# Altium schematic sheet dc_motor.SchDoc
size A4; Engineer: Amir Hossein Jobeiri; Organization: Simaran; SheetNumber: 4; SheetTotal: 24
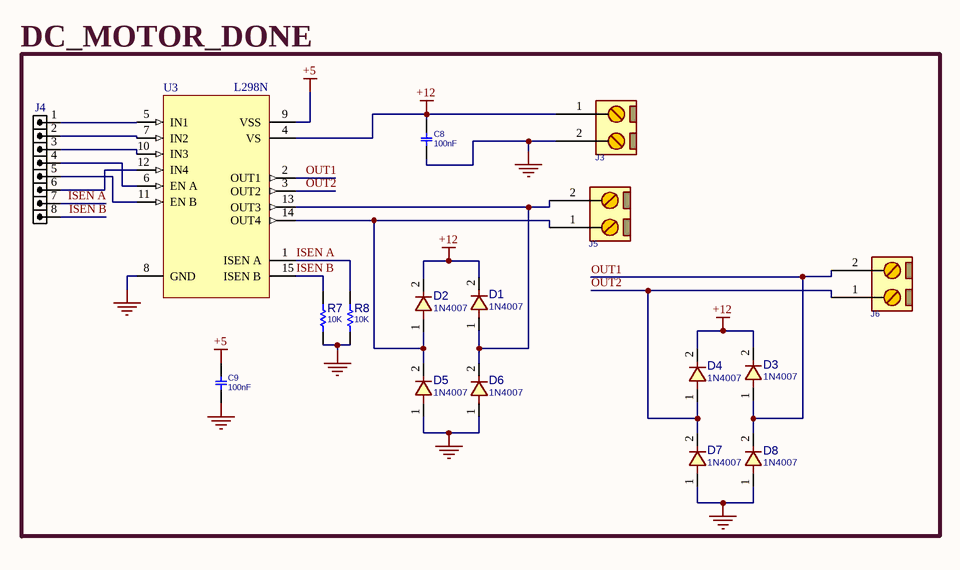
[diagram p0: dc_motor.SchDoc]

## Parts
C8  100nF  [C_CER_D3]
C9  100nF  [C_CER_D3]
D1  1N4007  [D_AX04_DO41]
D2  1N4007  [D_AX04_DO41]
D3  1N4007  [D_AX04_DO41]
D4  1N4007  [D_AX04_DO41]
D5  1N4007  [D_AX04_DO41]
D6  1N4007  [D_AX04_DO41]
D7  1N4007  [D_AX04_DO41]
D8  1N4007  [D_AX04_DO41]
J3  CONN_TB2  [TBG_2]  (value not drawn)
J4  HDR1X8  [HDR_M_1X8]  (value not drawn)
J5  CONN_TB2  [TBG_2]  (value not drawn)
J6  CONN_TB2  [TBG_2]  (value not drawn)
R7  10K  [R025W_AX04]
R8  10K  [R025W_AX04]
U3  L298N  [MULTIWATT_15V]

## Blocks framed on the sheet
DC_MOTOR_DONE: C8 C9 D1-D8 J3-J6 R7 R8 U3

## Nets
+5: C9.2 U3.9(VSS)
+12: C8.2 D1.2 D2.2 D3.2 D4.2 J3.1 U3.4(VS)
GND: C8.1 C9.1 D5.1 D6.1 D7.1 D8.1 J3.2 R7.2 R8.2 U3.8(GND)
ISEN A: J4.7 R8.1 U3.1(ISEN_A)
ISEN B: J4.8 R7.1 U3.15(ISEN_B)
OUT1: D3.1 D8.2 J6.2 U3.2(OUT1)
OUT2: D4.1 D7.2 J6.1 U3.3(OUT2)
NetD1_1: D1.1 D6.2 J5.2 U3.13(OUT3)
NetD2_1: D2.1 D5.2 J5.1 U3.14(OUT4)
NetJ4_1: J4.1 U3.5(IN1)
NetJ4_2: J4.2 U3.7(IN2)
NetJ4_3: J4.3 U3.10(IN3)
NetJ4_4: J4.4 U3.6(EN_A)
NetJ4_5: J4.5 U3.11(EN_B)
NetJ4_6: J4.6 U3.12(IN4)

## Library data of the parts
C8 C9 = CAP_THD_CERML: CAP, THD, CER MULTI LAYER,; PARAM: 50V; DESC: CAP, CER MULTI LAYER,; MANF_P#: MANF_PART#; PRICE: 100= 1$; MANF: MANF; PARAM2: PARAM2; ASSEMBLY: ASSEMBLY; VALUE: 100nF
D1-D8 = DIODE_SMD_1N4007: DIODE, GENERAL PURPOSE, 1000V/1A; MANF: Kingtronics; DESC: DESCRIPTION; PARAM: 1000V VRRM; PARAM2: 1A; MANF_P#: M7; ASSEMBLY: ASSEMBLY; PRICE: PRICE; VALUE: 1N4007
J3 J5 J6 = CONN_TB2: CONN, TERMINAL BLOCK, 5.08mm pitch; VALUE: CONN_TB2
J4 = HDR_M_1X8: CONN, HEADER, Male, pitch: 2.54mm, 8POS; VALUE: HDRM8
R7 R8 = RES_THD: RESISTOR, THD; MANF_P#: RK73H1ETTP4701F; MANF: KOA SPEER; PARAM: 0.063W; DESC: DESCRIPTION; DIST#: MOUSER; PARAM2: 1%; ASSEMBLY: ASSEMBLY; PRICE: 100= 0.5$; VALUE: 10K
U3 = L298N: CREATED BY J; VALUE: L298N; PARAM: *; PARAM2: *; MANF: *; MANF_P#: *